# EAGLE design Schematic (EAGLE 7.7.0)
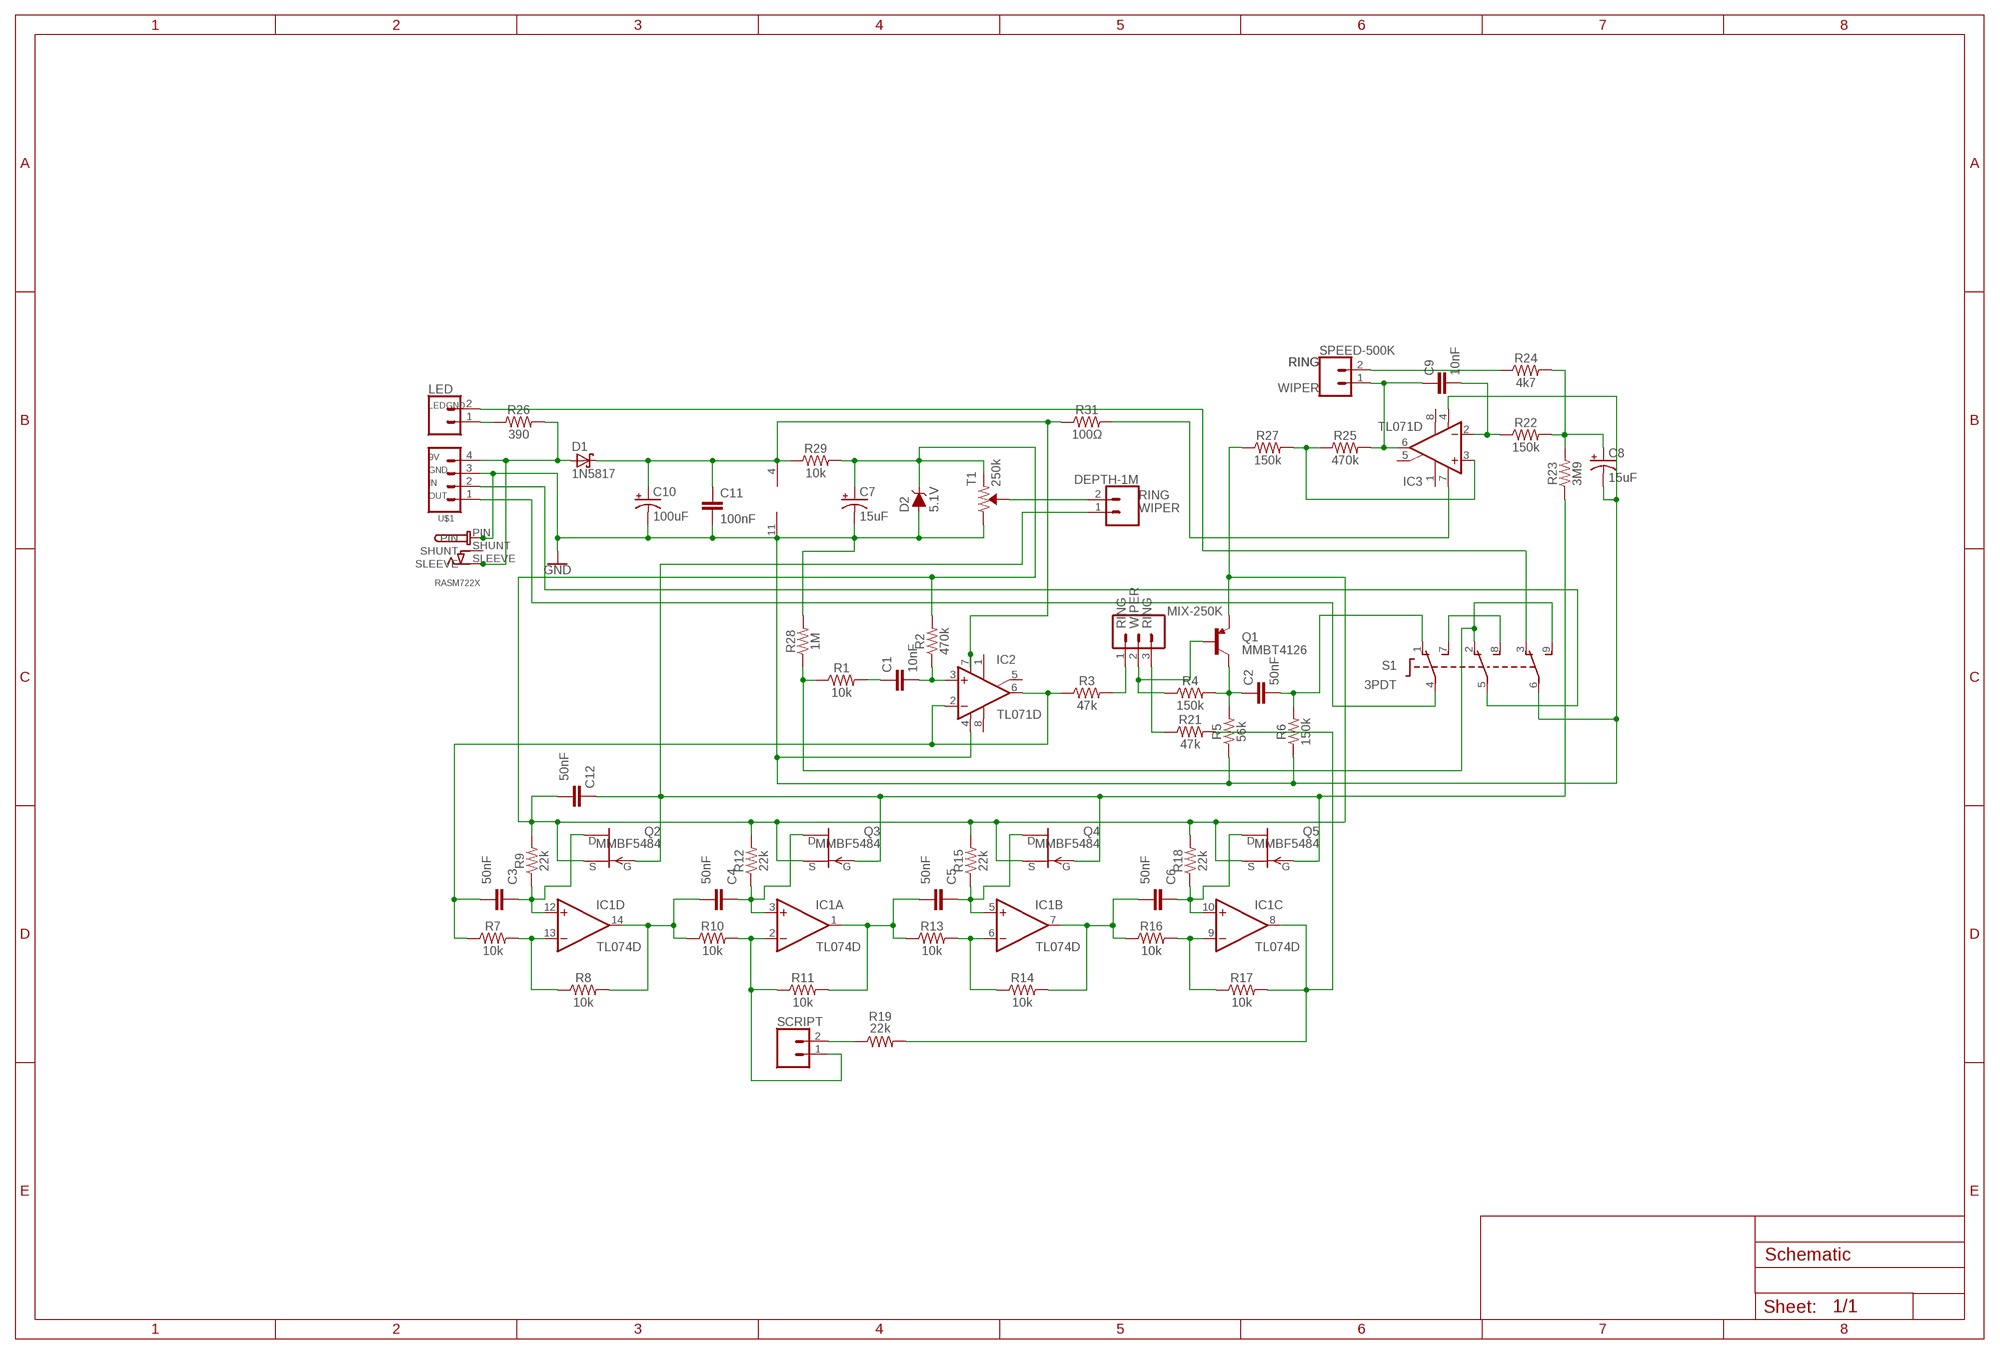
[diagram p0: schematic, sheet 1]

## Parts
C1  10nF  0.1UF-0603-25V-(+80/-20%)  [0603]
C2  50nF  0.1UF-0603-25V-(+80/-20%)  [0603]
C3  50nF  10NF-0603-50V-10%  [0603]
C4  50nF  10NF-0603-50V-10%  [0603]
C5  50nF  10NF-0603-50V-10%  [0603]
C6  50nF  10NF-0603-50V-10%  [0603]
C7  15uF  100UF-POLAR-EIA7343-10V-10%(TANT)  [EIA7343]
C8  15uF  100UF-POLAR-EIA7343-10V-10%(TANT)  [EIA7343]
C9  10nF  0.1UF-0603-25V-(+80/-20%)  [0603]
C10  100uF  100UF-POLAR-EIA7343-10V-10%(TANT)  [EIA7343]
C11  100nF  0.1UF-0603-25V-(+80/-20%)  [0603]
C12  50nF  10NF-0603-50V-10%  [0603]
D1  1N5817  1N5817-T  [DO41-7.6]
D2  5.1V  DIODE-ZENER-BZT52C3V6S  [SOD-323]
DEPTH-1M  CONN_02  [1X02]
IC1  TL074D  [SO14]
IC2  TL071D  [SO08]
IC3  TL071D  [SO08]
J2  CONN_04  [1X04]
LED  CONN_02  [1X02]
MIX-250K  CONN_03  [1X03]
Q1  MMBT4126  TRANSISTOR_PNPMMBT4403  [SOT23-3]
Q2  MMBF5484  SST5484  [SOT23]
Q3  MMBF5484  SST5484  [SOT23]
Q4  MMBF5484  SST5484  [SOT23]
Q5  MMBF5484  SST5484  [SOT23]
R1  10k  10KOHM-0603-1/10W-1%  [0603]
R2  470k  22KOHM-0603-1/10W-1%  [0603]
R3  47k  10KOHM-0603-1/10W-1%  [0603]
R4  150k  10KOHM-0603-1/10W-1%  [0603]
R5  56k  22KOHM-0603-1/10W-1%  [0603]
R6  150k  22KOHM-0603-1/10W-1%  [0603]
R7  10k  10KOHM-0603-1/10W-1%  [0603]
R8  10k  10KOHM-0603-1/10W-1%  [0603]
R9  22k  22KOHM-0603-1/10W-1%  [0603]
R10  10k  10KOHM-0603-1/10W-1%  [0603]
R11  10k  10KOHM-0603-1/10W-1%  [0603]
R12  22k  22KOHM-0603-1/10W-1%  [0603]
R13  10k  10KOHM-0603-1/10W-1%  [0603]
R14  10k  10KOHM-0603-1/10W-1%  [0603]
R15  22k  22KOHM-0603-1/10W-1%  [0603]
R16  10k  10KOHM-0603-1/10W-1%  [0603]
R17  10k  10KOHM-0603-1/10W-1%  [0603]
R18  22k  22KOHM-0603-1/10W-1%  [0603]
R19  22k  10KOHM-0603-1/10W-1%  [0603]
R21  47k  10KOHM-0603-1/10W-1%  [0603]
R22  150k  10KOHM-0603-1/10W-1%  [0603]
R23  3M9  10KOHM-0603-1/10W-1%  [0603]
R24  4k7  10KOHM-0603-1/10W-1%  [0603]
R25  470k  10KOHM-0603-1/10W-1%  [0603]
R26  390  10KOHM-0603-1/10W-1%  [0603]
R27  150k  10KOHM-0603-1/10W-1%  [0603]
R28  1M  10KOHM-0603-1/10W-1%  [0603]
R29  10k  10KOHM-0603-1/10W-1%  [0603]
R31  100Ω  10KOHM-0603-1/10W-1%  [0603]
S1  3PDT  [3PDT]
SCRIPT  CONN_02  [1X02]
SPEED-500K  CONN_02  [1X02]
T1  250k  TRIMPOT-SMD-3MM-CLOSED-1/8W-20%  [TRIMPOT-SMD-3MM-CLOSED]
U$1  RASM722X  [SWITCHCRAFT_RASM722X]

## Nets
4: C10.A(+) C11.1 D1.C IC1.4(P:V+) IC2.7(V+) R29.1 R31.1
9V: D1.A J2.4 R26.2 U$1.SLEEVE
GND: C7.C(-) C8.C(-) C10.C(-) C11.2 D2.A IC1.11(P:V-) IC2.4(V-) IC3.4(V-) J2.3 R5.1 R6.1 R28.2 S1.6(P3) T1.3(CW) U$1.PIN
IN: J2.2 S1.5(P2)
INN: R1.1 R28.1 S1.2(O2) S1.9(S3)
LEDGND: LED.2 S1.3(O3)
N$1: C4.2 IC1.14(D:OUT) R8.2 R10.1
N$2: IC1.13(D:-IN) R7.2 R8.1
N$3: MIX-250K.1 R3.2
N$4: C1.2 IC2.3(+IN) R2.1
N$5: C3.1 IC1.12(D:+IN) Q2.1(D) R9.1
N$6: MIX-250K.3 R21.1
N$7: C6.2 IC1.7(B:OUT) R14.2 R16.1
N$8: C5.2 IC1.1(A:OUT) R11.2 R13.1
N$9: IC1.2(A:-IN) R10.2 R11.1 SCRIPT.1
N$10: R19.1 SCRIPT.2
N$11: C4.1 IC1.3(A:+IN) Q3.1(D) R12.1
N$12: LED.1 R26.1
N$13: IC1.6(B:-IN) R13.2 R14.1
N$14: IC1.8(C:OUT) R17.2 R19.2 R21.2
N$15: C5.1 IC1.5(B:+IN) Q4.1(D) R15.1
N$16: MIX-250K.2 Q1.1(B) R4.1
N$17: C1.1 R1.2
N$18: IC1.9(C:-IN) R16.2 R17.1
N$19: C3.2 IC2.2(-IN) IC2.6(OUT) R3.1 R7.1
N$20: C6.1 IC1.10(C:+IN) Q5.1(D) R18.1
N$21: C12.1 DEPTH-1M.1 Q2.3(G) Q3.3(G) Q4.3(G) Q5.3(G) R23.1
N$22: C2.1 Q1.3(C) R4.2 R5.2
N$23: IC3.7(V+) R31.2
N$24: C9.2 IC3.2(-IN) R22.1
N$25: C8.A(+) R22.2 R23.2 R24.2
N$26: C7.A(+) C12.2 D2.C Q1.2(E) Q2.2(S) Q3.2(S) Q4.2(S) Q5.2(S) R2.2 R9.2 R12.2 R15.2 R18.2 R27.1 R29.2 T1.1(CCW)
N$28: C2.2 R6.2 S1.1(O1)
N$29: IC3.3(+IN) R25.1 R27.2
N$31: S1.7(S1) S1.8(S2)
OUT: J2.1 S1.4(P1)
QWEF: DEPTH-1M.2 T1.2(WIPER)
RING: R24.1 SPEED-500K.2
WIPER: C9.1 IC3.6(OUT) R25.2 SPEED-500K.1
Unconnected: IC2.1(ON1) IC2.5(ON2) IC2.8(OPT) IC3.1(ON1) IC3.5(ON2) IC3.8(OPT)

## Power pins joined to a net without a drawn wire
SHUNT: U$1.SHUNT

## Library data of the parts
C1 C2 C9 C11 = SparkFun-Capacitors:0.1UF: 0.1µF ceramic capacitors A capacitor is a passive two-terminal electrical component used to store electrical energy temporarily in an electric field.; PROD_ID: CAP-00810; VALUE: 0.1uF
C3-C6 C12 = SparkFun-Capacitors:10NF: 0.01uF/10nF/10,000pF ceramic capacitors A capacitor is a passive two-terminal electrical component used to store electrical energy temporarily in an electric field. CAP-09321; PROD_ID: CAP-00867; VALUE: 10nF
C7 C8 = SparkFun-Capacitors:100UF-POLAR: 100µF polarized capacitors A capacitor is a passive two-terminal electrical component used to store electrical energy temporarily in an electric field.; PROD_ID: CAP-07890; VALUE: 100uF
C10 = SparkFun-Capacitors:100UF-POLAR: 100µF polarized capacitors A capacitor is a passive two-terminal electrical component used to store electrical energy temporarily in an electric field.; PROD_ID: CAP-07890
D1 = diode:1N581*: 1.0A SCHOTTKY BARRIER RECTIFIER Source: http://www.diodes.com/datasheets/ds23001.pdf
D2 = SparkFun-DiscreteSemi:DIODE-ZENER: Zener Diode A Zener diode allows current to flow from its anode to its cathode like a normal semiconductor diode, but it also permits current to flow in the reverse direction when its "Zener voltage" is reached. - WIkipedia; PROD_ID: DIO-08199; VALUE: 3.6V
DEPTH-1M LED SCRIPT SPEED-500K = SparkFun-Connectors:CONN_02: Multi connection point. Often used as Generic Header-pin footprint for 0.1 inch spaced/style header connections On any of the 0.1 inch spaced packages, you can populate with these: Break Away Headers - Straight <https://www.sparkfun.com/products/116> (PRT-00116) Break Away Male Headers - Right Angle <https://www.sparkfun.com/products/553> (PRT-00553) Female Headers <https://www.sparkfun.com/products/115> (PRT-00115) Break Away Headers - Machine Pin <https://www.sparkfun.com/products/117> (PRT-00117) Break Away Female Headers - Swiss Machine Pin <https://www.sparkfun.com/products/743> (PRT-00743) For SCREWTERMINALS and SPRING TERMINALS visit here: Screw Terimnals on SparkFun.com <https://www.sparkfun.com/search/results?term=Screw+Terminals> (5mm/3.5mm/2.54mm spacing) This device is also useful as a general connection point to wire up your design to another part of your project. Our various solder wires solder well into these plated through hole pads. Hook-Up Wire - Assortment (Stranded, 22 AWG) <https://www.sparkfun.com/products/11375> (PRT-11375) Hook-Up Wire - Assortment (Solid Core, 22 AWG) <https://www.sparkfun.com/products/11367> (PRT-11367) View the entire wire category on our website here <https://www.sparkfun.com/categories/141> Special notes: Molex polarized connector foot print use with: PRT-08233 with associated crimp pins and housings. 2.54_SCREWTERM for use with PRT-10571. 3.5mm Screw Terminal footprints for PRT-08084 5mm Screw Terminal footprints for use with PRT-08432
IC1 = linear:TL074: OP AMP
IC2 IC3 = linear:TL071: OP AMP
J2 = SparkFun-Connectors:CONN_04: Multi connection point. Often used as Generic Header-pin footprint for 0.1 inch spaced/style header connections On any of the 0.1 inch spaced packages, you can populate with these: Break Away Headers - Straight <https://www.sparkfun.com/products/116> (PRT-00116) Break Away Male Headers - Right Angle <https://www.sparkfun.com/products/553> (PRT-00553) Female Headers <https://www.sparkfun.com/products/115> (PRT-00115) Break Away Headers - Machine Pin <https://www.sparkfun.com/products/117> (PRT-00117) Break Away Female Headers - Swiss Machine Pin <https://www.sparkfun.com/products/743> (PRT-00743) For SCREWTERMINALS and SPRING TERMINALS visit here: Screw Terimnals on SparkFun.com <https://www.sparkfun.com/search/results?term=Screw+Terminals> (5mm/3.5mm/2.54mm spacing) This device is also useful as a general connection point to wire up your design to another part of your project. Our various solder wires solder well into these plated through hole pads. Hook-Up Wire - Assortment (Stranded, 22 AWG) <https://www.sparkfun.com/products/11375> (PRT-11375) Hook-Up Wire - Assortment (Solid Core, 22 AWG) <https://www.sparkfun.com/products/11367> (PRT-11367) View the entire wire category on our website here <https://www.sparkfun.com/categories/141> Special notes: Molex polarized connector foot print use with SKU : PRT-08231 with associated crimp pins and housings. 1MM SMD Version SKU: PRT-10208; PROD_ID: CONN-09696
MIX-250K = SparkFun-Connectors:CONN_03: Multi connection point. Often used as Generic Header-pin footprint for 0.1 inch spaced/style header connections On any of the 0.1 inch spaced packages, you can populate with these: Break Away Headers - Straight <https://www.sparkfun.com/products/116> (PRT-00116) Break Away Male Headers - Right Angle <https://www.sparkfun.com/products/553> (PRT-00553) Female Headers <https://www.sparkfun.com/products/115> (PRT-00115) Break Away Headers - Machine Pin <https://www.sparkfun.com/products/117> (PRT-00117) Break Away Female Headers - Swiss Machine Pin <https://www.sparkfun.com/products/743> (PRT-00743) Stackable Header - 3 Pin (Female, 0.1") <https://www.sparkfun.com/products/13875> (PRT-13875) For SCREWTERMINALS and SPRING TERMINALS visit here: Screw Terimnals on SparkFun.com <https://www.sparkfun.com/search/results?term=Screw+Terminals> (5mm/3.5mm/2.54mm spacing) This device is also useful as a general connection point to wire up your design to another part of your project. Our various solder wires solder well into these plated through hole pads. Hook-Up Wire - Assortment (Stranded, 22 AWG) <https://www.sparkfun.com/products/11375> (PRT-11375) Hook-Up Wire - Assortment (Solid Core, 22 AWG) <https://www.sparkfun.com/products/11367> (PRT-11367) View the entire wire category on our website here <https://www.sparkfun.com/categories/141> Special notes: Molex polarized connector foot print use with SKU : PRT-08232 with associated crimp pins and housings.
Q1 = User-Submitted:TRANSISTOR_PNP: Generic PNP BJT Double check pinouts against datasheets- not all devices are the same! MMBT3906 - 40V 200mA SOT-23 (TRANS-08052) MMBT4403 - 40V 600mA SOT-23 (TRANS-09245); PROD_ID: TRANS-09245; VALUE: MMBT4403
Q2-Q5 = transistor-fet:?548*: N-Channel JFETs Source: VISHAY 2N5484.pdf Compatible: TO92 2N5245 J304 J305 U310 J308 J309 J310 TO72 2N4416 2N4416A 2N3823 2N4351 3N169 3N170 3N171 MFE3002 TO18 2N3796 2N3797 MFE825 Source: Motorola European Master Guide Pacge 3-59
R1 R7 R8 R10 R11 R13 R14 R16 R17 R29 = SparkFun-Resistors:10KOHM: 10kΩ resistor A resistor is a passive two-terminal electrical component that implements electrical resistance as a circuit element. Resistors act to reduce current flow, and, at the same time, act to lower voltage levels within circuits. - Wikipedia; PROD_ID: RES-00824
R2 R5 R6 = SparkFun-Resistors:22KOHM: 22kΩ resistor A resistor is a passive two-terminal electrical component that implements electrical resistance as a circuit element. Resistors act to reduce current flow, and, at the same time, act to lower voltage levels within circuits. - Wikipedia; PROD_ID: RES-07853; VALUE: 22k
R3 R4 R19 R21-R28 R31 = SparkFun-Resistors:10KOHM: 10kΩ resistor A resistor is a passive two-terminal electrical component that implements electrical resistance as a circuit element. Resistors act to reduce current flow, and, at the same time, act to lower voltage levels within circuits. - Wikipedia; PROD_ID: RES-00824; VALUE: 10k
R9 R12 R15 R18 = SparkFun-Resistors:22KOHM: 22kΩ resistor A resistor is a passive two-terminal electrical component that implements electrical resistance as a circuit element. Resistors act to reduce current flow, and, at the same time, act to lower voltage levels within circuits. - Wikipedia; PROD_ID: RES-07853
S1 = switch:3PDT: 3PDT 9 pin footswitch SF17020F-0302-21R-L Source: 3PDT.jpg
T1 = SparkFun-Resistors:TRIMPOT: Trimming Potentiometer (Trimpot) Three-terminal potentiometers, with an adjustable wiper and two adjustable resistors. A pot can be used to create a configurable voltage divider, or as a variable resistor. "Trimpots" are a subset of potentiometers, usually intended for "set-and-forget" applications. They're often more delicate than standard potentiometers - rated for fewer turns. Variants PTH-KNOB - PTH Trimpot w/ finger-adjustable knob Trimpot 10K with Knob <https://www.sparkfun.com/products/9806> (COM-09806) Datasheet <http://www.sparkfun.com/datasheets/Components/General/TSR-3386.pdf> SMD-3MM-CLOSED-FRAME - SMD 3mm Square Closed-Frame Trimpot Used on e.g. EasyDriver - Stepper Motor Driver <https://www.sparkfun.com/products/12779> Datasheet <http://www.bitechnologies.com/pdfs/22.pdf> (22AR10KTR) SMD-5MM - SMD 5mm Square Closed-Frame Trimpot Used on e.g. IOIO-OTG - V2.2 <https://www.sparkfun.com/products/13613> Datasheet <http://www.vishay.com/docs/51008/ts53.pdf> (TS53YL502MR10) SMD-3MM-1/10W-25% - 3mm Square Open-Frame Trimpot Used on e.g. SparkFun Shapeoko <https://www.sparkfun.com/products/13899> Datasheet <http://www.bourns.com/docs/Product-Datasheets/TC33.pdf> (TC33X-2-103E); PROD_ID: RES-09285; VALUE: 10k
U$1 = RASM722X:RASM722X: Connector; Miniature Power Jack; 0.57 in.; 0.08; Surface Mount; AVAILABILITY: Good; DESCRIPTION: Connector; Miniature Power Jack; 0.57 in.; 0.08; Surface Mount; MF: Switchcraft; MP: RASM722X; PACKAGE: None; PRICE: 0.97 USD

## Net classes
0 default: width 0.152 mm, drill 0.33 mm, clearance 0.152 mm

## Board
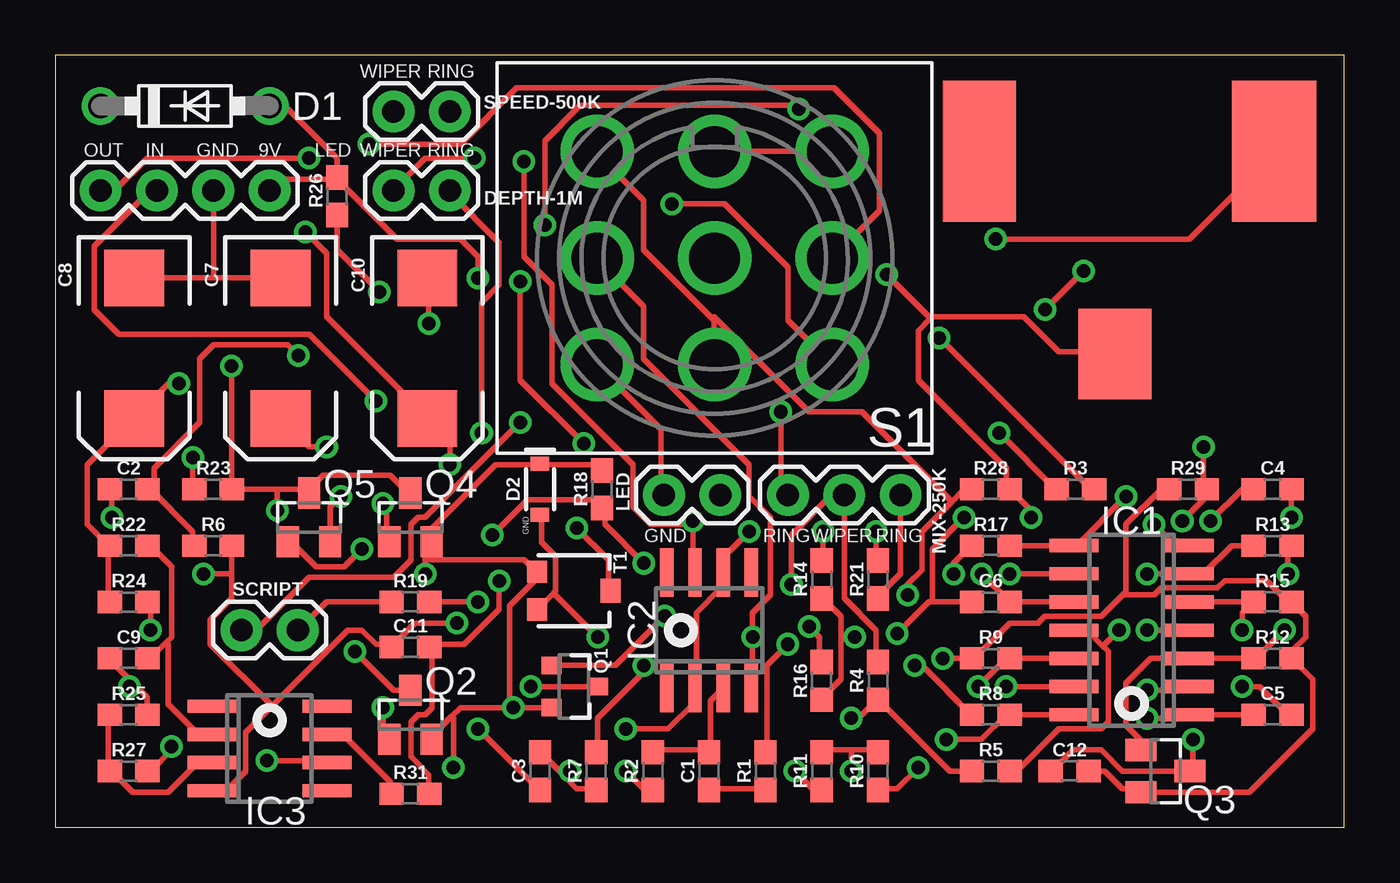
[diagram p1: board, top side]
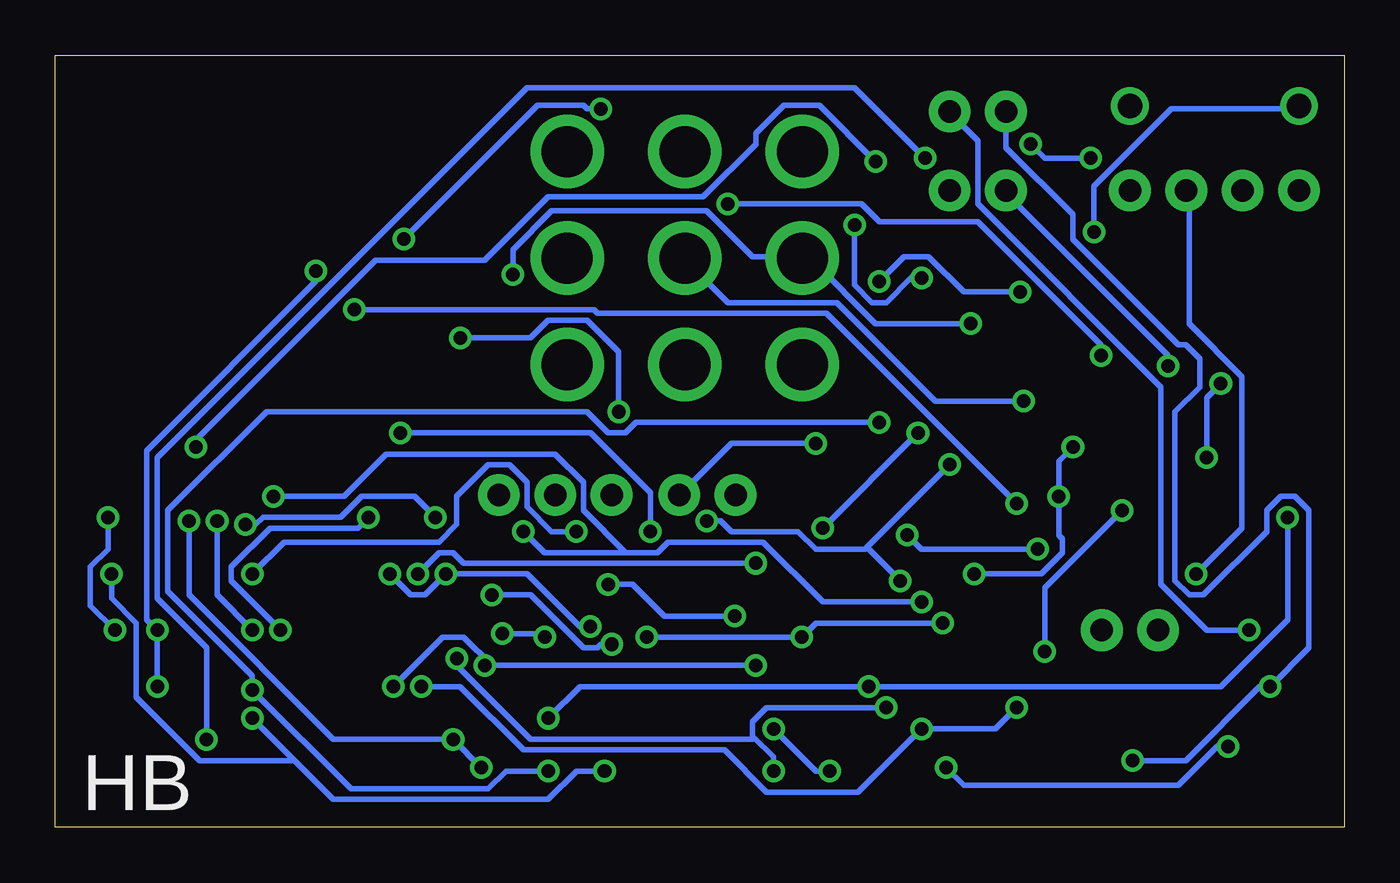
[diagram p2: board, bottom side, seen from below]

Size 58.09 x 34.79 mm. Coordinates in mm from the lower left corner, seen from the top.
Outline: 0,0 58.09,0 58.09,34.79 0,34.79 0,0
Copper layers (1*16): Top 0.035mm / dielectric 1.5mm / Bottom 0.035mm
Design rules "default": minimum track width 10mil, minimum drill 24mil, track to track 8mil, track to pad 8mil, pad to pad 8mil, via to via 8mil, smd to smd 8mil, copper to edge 40mil, drill to drill 8mil, minimum pad ring 10mil, minimum via ring 8mil, stop-mask expansion 4mil, vias tented up to drill 0mil, thermal gap 10mil

### Footprints (pad centres in the part's own frame; a part is rotated, then mirrored left to right if it is on the bottom)
0603 = smd 1.1 x 1: 1 -0.85,0; 2 0.85,0
EIA7343 = smd 2.55 x 2.7: A 3.17,0; C -3.17,0
DO41-7.6 = drill 1.1 pad 1.7: A 3.81,0; C -3.81,0
SOD-323 = smd 0.63 x 0.83: A 1.15,0; C -1.15,0
1X02 = drill 1.016 pad 1.88: 1 0,0; 2 2.54,0
SO14 = smd 0.6 x 2.2: 1 -3.81,-2.6; 2 -2.54,-2.6; 3 -1.27,-2.6; 4 0,-2.6; 5 1.27,-2.6; 6 2.54,-2.6; 7 3.81,-2.6; 8 3.81,2.6; 9 2.54,2.6; 10 1.27,2.6; 11 0,2.6; 12 -1.27,2.6; 13 -2.54,2.6; 14 -3.81,2.6
SO08 = smd 0.6 x 2.2: 1 -1.905,-2.6; 2 -0.635,-2.6; 3 0.635,-2.6; 4 1.905,-2.6; 5 1.905,2.6; 6 0.635,2.6; 7 -0.635,2.6; 8 -1.905,2.6
1X04 = drill 1.016 pad 1.88: 1 0,0; 2 2.54,0; 3 5.08,0; 4 7.62,0
1X03 = drill 1.016 pad 1.88: 1 0,0; 2 2.54,0; 3 5.08,0
SOT23-3 = smd 0.8 x 0.9: 1 -0.95,-1; 2 0.95,-1; 3 0,1.1
SOT23 = smd 1 x 1.4: 1 -0.95,-1.1; 2 0.95,-1.1; 3 0,1.1
3PDT = drill 2.3 pad 3.1: 1 -5.3,4.8; 2 0,4.8; 3 5.3,4.8; 4 -5.3,0; 5 0,0; 6 5.3,0; 7 -5.3,-4.8; 8 0,-4.8; 9 5.3,-4.8
TRIMPOT-SMD-3MM-CLOSED = smd 1 x 0.9: 1 -0.85,-1.65; 3 0.85,-1.65 | smd 1.1 x 0.9: 2 0,1.65
SWITCHCRAFT_RASM722X = smd 3.3 x 4.06: PIN 0,0 | smd 3.3 x 6.35: SHUNT 6.099,-9.14 | smd 3.81 x 6.35: SLEEVE -7.189,-9.14

### Placement (x,y rotation side)
C1  29.46,2.54 90 top
C2  3.3,15.24 0 top
C3  21.84,2.54 90 top
C4  54.86,15.24 180 top
C5  54.86,5.08 180 top
C6  42.16,10.16 180 top
C7  10.16,21.59 270 top
C8  3.56,21.59 270 top
C9  3.3,7.62 0 top
C10  16.76,21.59 270 top
C11  16,8.13 180 top
C12  45.72,2.54 0 top
D1  5.84,32.51 0 top
D2  21.84,15.24 270 top
DEPTH-1M  15.24,28.7 0 top
IC1  48.51,8.89 90 top
IC2  29.46,8.89 0 top
IC3  9.65,3.56 270 top
J2  2.03,28.7 0 top
LED  29.97,14.99 180 top
MIX-250K  33.02,14.99 0 top
Q1  23.37,6.35 270 top
Q2  16,5.08 0 top
Q3  50.04,2.54 270 top
Q4  16,13.97 0 top
Q5  11.43,13.97 0 top
R1  32,2.54 270 top
R2  26.92,2.54 270 top
R3  45.97,15.24 0 top
R4  37.08,6.6 270 top
R5  42.16,2.54 180 top
R6  7.11,12.7 180 top
R7  24.38,2.54 90 top
R8  42.16,5.08 0 top
R9  42.16,7.62 180 top
R10  37.08,2.54 90 top
R11  34.54,2.54 270 top
R12  54.86,7.62 0 top
R13  54.86,12.7 180 top
R14  34.54,11.18 270 top
R15  54.86,10.16 0 top
R16  34.54,6.6 90 top
R17  42.16,12.7 0 top
R18  24.64,15.24 90 top
R19  16,10.16 0 top
R21  37.08,11.18 90 top
R22  3.3,12.7 180 top
R23  7.11,15.24 180 top
R24  3.3,10.16 180 top
R25  3.3,5.08 0 top
R26  12.7,28.45 90 top
R27  3.3,2.54 180 top
R28  42.16,15.24 0 top
R29  51.05,15.24 180 top
R31  16,1.52 180 top
S1  29.72,25.65 180 top
SCRIPT  8.38,8.89 0 top
SPEED-500K  15.24,32.26 0 top
T1  23.37,10.67 270 top
U$1  47.75,21.34 180 top

### Tracks (layer width: path | path; a pad name or v marks a point on that pad's centre or on a via)
4  (via drill 0.61)
  Top 0.254: 51.75,15.24 51.75,14.76 v50.8,13.81 | IC1.4 v49.21,8.89 | R31.1 16.83,1.59 16.83,2.38 16.03,3.17 16.03,4.76 16.35,5.08 16.67,5.08 16.99,5.4 16.99,8.1 C11.1 16.99,8.26 18.41,8.26 20,9.84 v20,11.11 | 28.73,13.65 28.73,11.59 IC2.7 | v17.78,16.35 17.78,17.46 16.83,18.41 C10.A 16.67,18.57 12.22,23.02 12.22,25.88 v11.27,26.83 | v51.75,17.14 51.75,15.24 | v21.11,30 21.11,25.72 22.38,24.45 22.38,20 26.04,16.35 26.04,14.45 26.83,13.65 28.73,13.65 | 51.75,15.24 R29.1 | 28.73,13.65 v28.73,13.81
  Bottom 0.254: v50.8,13.81 50.8,10.48 v49.21,8.89 | v28.73,13.81 28.1,13.81 27.62,13.34 24.61,13.34 23.81,12.54 21.59,12.54 21.51,12.62 | v17.78,16.35 21.51,12.62 | 21.51,12.62 v20,11.11 | v11.27,26.83 11.27,28.89 7.78,32.38 2.06,32.38 D1.C | v51.75,17.14 51.75,17.46 43.66,25.56 38.73,25.56 35.88,28.42 28.89,28.42 26.51,30.8 26.51,31.27 25.24,32.54 23.65,32.54 v21.11,30
9V  (via drill 0.61)
  Top 0.254: 12.7,29.21 10.16,29.21 J2.4 | D1.A 9.68,32.38 10.48,32.38 12.7,30.16 R26.2 12.7,29.21 | 12.7,29.21 15.4,26.51 18.26,26.51 19.05,25.72 v19.05,24.77 | v22.07,27.15 22.07,30.96 23.65,32.54 33.34,32.54 v33.5,32.38 | v42.39,26.51 51.12,26.51 54.93,30.32 U$1.SLEEVE
  Bottom 0.254: v19.05,24.77 19.53,24.77 20.64,23.65 21.27,23.65 22.07,24.45 v22.07,27.15 | v33.5,32.38 34.13,32.38 34.29,32.54 36.35,32.54 v42.39,26.51
GND  (via drill 0.61)
  Top 0.254: 7.14,24.77 C7.C | 7.14,24.77 3.65,24.77 C8.C | 7.14,24.77 7.14,28.57 J2.3 | 9.76,5.48 8.57,4.29 8.57,2.54 7.78,1.75 7.14,1.75 IC3.4 | 9.76,5.48 13.18,8.89 13.81,8.89 14.45,8.26 15.08,8.26 C11.2 15.24,8.26 16.19,9.21 v18.1,9.21 | 7.94,11.43 7.94,10.32 6.99,9.37 6.99,8.26 9.76,5.48 | 7.94,11.43 7.94,12.7 R6.1 | 7.94,11.43 v6.67,11.43 | R5.1 43.34,2.54 45.24,4.45 47.15,4.45 47.47,4.76 47.47,7.94 47.23,8.18 | 47.23,8.18 46.51,8.89 IC1.11 | 39.45,22.94 39.53,23.02 43.66,23.02 45.24,21.43 47.62,21.43 U$1.PIN | 39.45,22.94 38.89,22.38 38.89,20.16 42.86,16.19 42.86,15.24 R28.2 43.02,15.24 43.97,14.29 v43.97,13.97 | v47.94,8.89 47.23,8.18 | 22.46,10.56 21.75,9.84 T1.3 | 22.46,10.56 22.54,10.64 22.54,12.22 21.91,12.86 21.91,13.97 D2.A | IC2.4 31.43,6.35 v31.43,8.57 31.43,9.68 32.23,10.48 32.23,13.97 31.27,14.92 31.27,16.35 26.51,21.11 26.51,23.5 24.45,25.56 S1.6 | v24.45,8.57 22.46,10.56 | v16.83,22.7 16.83,24.61 C10.C | v37.47,24.92 39.45,22.94
  Bottom 0.254: v6.67,11.43 4.6,13.49 4.6,20.32 6.99,22.7 6.99,28.57 J2.3 | v47.94,8.89 50.16,11.11 50.16,11.75 48.42,13.49 44.45,13.49 v43.97,13.97 | v31.43,8.57 v24.45,8.57 23.81,9.21 v18.1,9.21 | v16.83,22.7 21.11,22.7 23.97,25.56 24.29,25.56 S1.6 24.45,25.72 26.67,25.72 28.73,27.78 35.72,27.78 37.47,26.04 v37.47,24.92
IN  (via drill 0.61)
  Top 0.254: v14.45,19.21 11.43,22.23 2.86,22.23 1.75,23.34 1.75,26.19 4.13,28.57 4.45,28.57 J2.2
  Bottom 0.254: v14.45,19.21 18.41,19.21 22.86,23.65 27.78,23.65 29.69,25.56 S1.5
INN  (via drill 0.61)
  Top 0.254: v33.02,8.26 32.07,7.3 32.07,3.49 R1.1 | v38.42,10.48 38.42,10.95 39.05,11.59 39.05,13.34 40.4,14.68 | 40.4,14.68 40.96,15.24 R28.1 | 29.61,22.94 26.51,26.04 26.51,28.26 24.45,30.32 S1.9 | 29.61,22.94 29.69,22.86 29.69,20.95 S1.2 | 40.4,14.68 36.35,18.73 33.97,18.73 29.69,23.02 29.61,22.94
  Bottom 0.254: v33.02,8.26 33.5,8.26 33.66,8.1 34.29,8.1 36.67,10.48 v38.42,10.48
LEDGND
  Top 0.254: LED.2 27.3,15.08 27.3,17.94 24.45,20.8 S1.3
N$1  (via drill 0.61)
  Top 0.254: v38.89,2.7 37.94,1.75 37.15,1.75 R10.1 | v40.16,3.97 41.75,3.97 42.86,5.08 R8.2 IC1.14 | C4.2 53.5,15.24 v52.07,13.81
  Bottom 0.254: v38.89,2.7 v40.16,3.97 45.56,3.97 52.07,10.48 v52.07,13.81
N$2  (via drill 0.61)
  Top 0.254: v26.51,7.3 26.51,6.99 24.45,4.92 24.45,3.49 R7.2 | v38.73,7.3 39.05,7.3 41.27,5.08 R8.1 | v42.86,6.35 IC1.13
  Bottom 0.254: 38.42,7.3 v26.51,7.3 | v42.86,6.35 40.64,8.57 39.69,8.57 38.42,7.3 | 38.42,7.3 v38.73,7.3
N$3  (via drill 0.61)
  Top 0.254: v39.85,22.07 46.67,15.24 R3.2 | v32.7,18.73 32.7,15.4 33.02,15.08 MIX-250K.1
  Bottom 0.254: v39.85,22.07 36.67,22.07 35.88,22.86 34.13,22.86 32.7,21.43 v32.7,18.73
N$4
  Top 0.254: R2.1 26.99,3.49 29.37,3.49 C1.2 29.53,3.49 29.53,5.71 30,6.19 IC2.3
N$5  (via drill 0.61)
  Top 0.254: IC1.12 R9.1 42.86,7.62 v41.59,6.35 | v19.05,4.45 21.75,1.75 C3.1 | v14.76,5.4 14.76,4.29 14.92,4.13 Q2.1
  Bottom 0.254: v14.76,5.4 15.72,4.45 v19.05,4.45 21.91,1.59 26.04,1.59 27.94,3.49 36.99,3.49 39.85,6.35 v41.59,6.35
N$6
  Top 0.254: MIX-250K.3 38.1,11.43 37.15,10.48 R21.1
N$7  (via drill 0.61)
  Top 0.254: 35.4,8.57 35.4,9.53 34.61,10.32 R14.2 | 35.4,8.57 35.4,6.67 34.61,5.87 R16.1 | 39.53,10.16 39.37,10.16 v37.94,8.73 | 39.53,10.16 C6.2 | 35.4,8.57 v36.04,8.57 | IC1.7 50.48,12.7 v49.53,13.65 | v40.96,13.97 39.53,12.54 39.53,10.16
  Bottom 0.254: v37.94,8.73 36.2,8.73 v36.04,8.57 | v49.53,13.65 49.05,13.65 48.74,13.97 45.24,13.97 44.29,14.92 41.91,14.92 v40.96,13.97
N$8  (via drill 0.61)
  Top 0.254: v33.34,2.54 34.13,1.75 34.45,1.75 R11.2 | v49.21,4.92 50.8,4.92 50.96,5.08 IC1.1 C5.2 | v55.56,11.43 55.56,12.7 R13.1
  Bottom 0.254: v33.34,2.54 34.61,2.54 35.88,1.27 45.56,1.27 47.39,3.1 | v49.21,4.92 47.39,3.1 | v55.56,11.43 55.56,10.32 54.45,9.21 54.45,5.87 51.59,3.02 47.47,3.02 47.39,3.1
N$9  (via drill 0.61)
  Top 0.254: 35.88,3.49 36.99,3.49 R10.2 | 35.88,3.49 34.61,3.49 R11.1 | v35.88,2.54 35.88,3.49 | v49.21,6.19 50.8,6.19 50.96,6.35 IC1.2 | SCRIPT.1 9.05,8.89 11.43,11.27 15.24,11.27 16.03,12.06 16.03,13.65 16.35,13.97 16.67,13.97 v20.95,18.26
  Bottom 0.254: v35.88,2.54 37.78,2.54 38.58,1.75 44.77,1.75 v49.21,6.19 49.21,6.83 53.02,10.64 53.02,14.29 48.58,18.73 34.13,18.73 33.18,17.78 32.38,17.78 31.91,18.26 v20.95,18.26
N$10
  Top 0.254: R19.1 12.22,10.16 10.95,8.89 SCRIPT.2
N$11  (via drill 0.61)
  Top 0.254: v55.72,13.97 C4.1 | v55.4,8.89 54.13,7.62 R12.1 IC1.3 49.37,7.62 48.26,6.51 48.26,4.6 48.9,3.97 48.9,3.49 Q3.1
  Bottom 0.254: v55.72,13.97 55.72,12.54 56.52,11.75 56.52,10 v55.4,8.89
N$12  (via drill 0.61)
  Top 0.254: R26.1 12.7,26.04 v14.61,24.13 | v20.95,24.61 20.95,20.16 v23.81,17.3
  Bottom 0.254: v14.61,24.13 17.14,24.13 18.73,25.72 19.84,25.72 v20.95,24.61 | v23.81,17.3 27.62,17.3 29.84,15.08 LED.1
N$13  (via drill 0.61)
  Top 0.254: v34.61,13.34 34.61,12.06 R14.1 | v49.21,11.43 IC1.6 51.75,11.43 53.02,12.7 R13.2
  Bottom 0.254: v34.61,13.34 35.72,13.34 36.83,14.45 36.83,15.56 37.62,16.35 38.58,16.35 40.01,14.92 40.01,13.65 40.8,12.86 47.78,12.86 v49.21,11.43
N$14  (via drill 0.61)
  Top 0.254: R17.2 IC1.8 46.04,12.7 v48.26,14.92 | v19.05,10.16 R19.2 | v36.99,13.34 36.99,12.06 R21.2
  Bottom 0.254: v19.05,10.16 23.5,10.16 26.19,12.86 30.48,12.86 30.96,12.38 32.38,12.38 | 32.38,12.38 36.04,12.38 v36.99,13.34 | v48.26,14.92 45.09,14.92 43.18,16.83 35.56,16.83 34.29,15.56 34.29,14.29 32.38,12.38
N$15  (via drill 0.61)
  Top 0.254: v53.5,6.35 54.29,6.35 55.56,5.08 C5.1 | v53.5,8.89 53.5,9.68 53.98,10.16 R15.1 IC1.5 | v14.76,14.61 14.92,14.45 14.92,13.02 Q4.1 | v46.35,25.08 v44.61,23.34
  Bottom 0.254: v53.5,6.35 v53.5,8.89 53.98,9.37 53.98,16.99 46.35,24.61 v46.35,25.08 | v14.76,14.61 23.34,23.18 33.66,23.18 33.81,23.34 v44.61,23.34
N$16  (via drill 0.61)
  Top 0.254: v27.46,9.53 25.24,7.3 22.38,7.3 Q1.1 | v33.18,10.95 33.18,13.18 34.92,14.92 35.56,14.92 | 35.56,14.92 35.56,10.32 36.99,8.89 36.99,7.46 R4.1 | 35.56,14.92 MIX-250K.2
  Bottom 0.254: v27.46,9.53 30.64,9.53 32.07,10.95 v33.18,10.95
N$17
  Top 0.254: C1.1 29.53,1.75 31.91,1.75 R1.2
N$18  (via drill 0.61)
  Top 0.254: v33.97,9.05 34.45,8.57 34.45,7.46 R16.2 | v40.48,11.43 40.48,11.91 41.27,12.7 R17.1 | v43.02,11.43 IC1.9
  Bottom 0.254: v33.97,9.05 34.45,9.05 36.83,11.43 v40.48,11.43 41.43,10.48 42.07,10.48 v43.02,11.43
N$19  (via drill 0.61)
  Top 0.254: 22.94,2.3 21.91,3.33 C3.2 | 22.94,2.3 23.5,1.75 24.29,1.75 R7.1 | v42.55,17.78 45.09,15.24 R3.1 | v31.27,13.34 30.16,12.22 30.16,11.59 IC2.6 30,11.43 30,10.79 28.89,9.68 28.89,6.35 IC2.2 28.73,6.19 28.73,5.56 27.62,4.45 v25.72,4.45 | v23.18,2.54 22.94,2.3
  Bottom 0.254: v42.55,17.78 33.97,17.78 31.27,15.08 v31.27,13.34 | v23.18,2.54 23.81,2.54 v25.72,4.45
N$20  (via drill 0.61)
  Top 0.254: v26.51,11.91 24.77,13.65 24.77,14.29 R18.1 24.61,14.45 24.29,14.76 21.27,14.76 v19.68,13.18 | 43.02,10.16 v41.75,11.43 | v13.81,12.54 13.02,11.75 11.75,11.75 10.64,12.86 Q5.1 | 43.02,10.16 IC1.10 | 43.02,10.16 C6.1
  Bottom 0.254: v26.51,11.91 39.69,11.91 40.16,12.38 40.8,12.38 v41.75,11.43 | v13.81,12.54 19.05,12.54 v19.68,13.18
N$21  (via drill 0.61)
  Top 0.254: 10,15.24 11.27,15.24 Q5.3 11.43,15.24 12.06,15.88 15.08,15.88 15.88,15.08 Q4.3 | 10,15.24 R23.1 7.94,15.24 v7.94,20.8 | v13.49,7.94 15.24,6.19 15.88,6.19 Q2.3 | 10,15.24 v10,14.29 | C12.1 44.93,2.54 45.88,3.49 47.15,3.49 48.1,2.54 Q3.3 51.28,2.54 v51.28,3.97 | v18.89,30.16 16.67,30.16 15.24,28.73 DEPTH-1M.1
  Bottom 0.254: v13.49,7.94 13.49,10.79 v10,14.29 | v51.28,3.97 51.28,8.1 53.5,10.32 53.5,16.67 36.83,33.34 22.07,33.34 v18.89,30.16 | v7.94,20.8 7.94,21.27 15.24,28.57 DEPTH-1M.1
N$22  (via drill 0.61)
  Top 0.254: v21.43,6.35 Q1.3 | v35.88,4.92 36.2,4.92 36.99,5.71 R4.2 37.15,5.71 40.32,2.54 R5.2 | v2.54,13.97 2.54,15.24 C2.1
  Bottom 0.254: v35.88,4.92 34.45,6.35 v21.43,6.35 5.56,6.35 2.54,9.37 v2.54,13.97
N$23
  Top 0.254: R31.2 15.08,1.59 15.08,2.06 13.02,4.13 12.38,4.13 IC3.7
N$24
  Top 0.254: 5,8.33 5.24,8.57 5.24,11.75 4.29,12.7 R22.1 | 5,8.33 4.29,7.62 C9.2 | IC3.2 6.99,4.29 6.35,4.29 5.08,5.56 5.08,8.26 5,8.33
N$25  (via drill 0.61)
  Top 0.254: 2.38,12.7 2.38,10.16 R24.2 | v6.19,16.67 6.19,15.24 R23.2 | v5.56,20 5.08,20 3.65,18.57 C8.A 3.49,18.41 1.43,16.35 1.43,13.65 2.38,12.7 | 2.38,12.7 R22.2
  Bottom 0.254: v6.19,16.67 6.19,19.37 v5.56,20
N$26  (via drill 0.61)
  Top 0.254: C12.2 47.31,2.54 48.1,1.75 48.9,1.75 Q3.2 49.05,1.59 53.82,1.59 56.67,4.45 56.67,6.67 R12.2 | R12.2 55.72,7.94 56.36,8.57 56.36,9.53 R15.2 55.56,10.16 54.61,11.11 52.7,11.11 52.39,10.79 49.85,10.79 49.53,10.48 48.26,10.48 48.18,10.56 | 48.18,10.56 48.26,10.64 48.26,13.65 49.85,15.24 R29.2 | 48.18,10.56 47.15,9.53 44.61,9.53 44.29,9.21 43.02,9.21 41.43,7.62 R9.2 v40.01,7.62 | R12.2 | v12.86,14.92 12.38,14.45 12.38,13.02 Q5.2 | v12.22,17.14 11.43,17.14 C7.A | R18.2 24.61,16.19 24.45,16.35 21.91,16.35 D2.C 21.75,16.35 19.84,16.35 16.99,13.49 16.99,13.02 Q4.2 16.83,12.86 16.67,12.7 16.67,12.06 | 16.67,12.06 v16.67,11.43 | 20.48,5.4 18.26,5.4 17.86,5 | 20.48,5.4 v20.64,5.4 22.23,5.4 Q1.2 | 17.86,5 16.99,4.13 Q2.2 | 20.48,5.4 20.48,10 21.59,11.11 21.59,11.43 T1.1 21.59,11.59 21.11,12.06 16.67,12.06 | v25.72,2.54 26.51,1.75 26.83,1.75 R2.2 | v5.24,3.65 5.24,3.49 4.29,2.54 R27.1 | v17.94,2.7 17.94,4.92 17.86,5
  Bottom 0.254: v12.22,17.14 12.86,16.51 v12.86,14.92 12.86,13.18 12.7,13.02 12.7,12.38 13.65,11.43 v16.67,11.43 | v25.72,2.54 25.72,3.17 26.59,4.05 | 26.59,4.05 26.67,4.13 26.67,4.76 26.04,5.4 v20.64,5.4 | v5.24,3.65 5.71,3.65 7.46,1.91 17.14,1.91 v17.94,2.7 | v40.01,7.62 40.01,7.3 36.67,3.97 26.67,3.97 26.59,4.05
N$28  (via drill 0.61)
  Top 0.254: R6.2 6.19,12.7 6.19,13.34 4.29,15.24 C2.2 4.45,15.24 4.45,16.19 6.51,18.26 6.51,21.11 7.14,21.75 10.48,21.75 v10.95,21.27 | v27.78,28.1 30.16,28.1 33.02,25.24 33.02,22.86 34.92,20.95 S1.1
  Bottom 0.254: v10.95,21.27 10.95,21.75 16.51,27.3 20.95,27.3 21.75,28.1 v27.78,28.1
N$29
  Top 0.254: R25.1 2.38,5.08 2.38,2.54 R27.2 2.54,2.54 3.49,1.59 5.08,1.59 6.35,2.86 6.99,2.86 IC3.3
N$31
  Top 0.254: S1.8 29.84,30.48 34.92,30.48 S1.7
OUT  (via drill 0.61)
  Top 0.254: v11.43,30.16 4.13,30.16 2.7,28.73 2.06,28.73 J2.1 | v14.13,30.8 18.26,30.8 20.8,33.34 35.08,33.34 37.15,31.27 37.15,27.78 35.08,25.72 S1.4
  Bottom 0.254: v11.43,30.16 13.49,30.16 v14.13,30.8
QWEF  (via drill 0.61)
  Top 0.254: v23.5,13.49 24.92,12.06 24.92,10.79 T1.2 | v19.21,17.78 19.21,23.65 20,24.45 20,26.35 17.78,28.57 DEPTH-1M.2
  Bottom 0.254: v19.21,17.78 v23.5,13.49
RING  (via drill 0.61)
  Top 0.254: v4.29,8.89 4.29,10.16 R24.1
  Bottom 0.254: v4.29,8.89 6.19,8.89 8.26,10.95 8.26,19.84 16.51,28.1 16.51,30.96 17.78,32.23 SPEED-500K.2
WIPER  (via drill 0.61)
  Top 0.254: 3.41,6.59 2.38,7.62 C9.1 | 3.41,6.59 4.13,5.87 4.13,5.08 R25.2 | v9.53,3.02 12.22,3.02 IC3.6 | v3.33,6.35 3.33,6.51 3.41,6.59
  Bottom 0.254: v9.53,3.02 7.14,3.02 3.81,6.35 v3.33,6.35 1.59,8.1 1.59,14.29 2.22,14.92 2.86,14.92 3.49,14.29 3.49,13.34 6.35,10.48 6.99,10.48 7.62,11.11 7.62,18.73 6.51,19.84 6.51,21.11 7.14,21.75 7.46,21.75 12.22,26.51 12.22,27.62 15.24,30.64 SPEED-500K.1

### Text on the board
tPlace: WIPER | RING | OUT | IN | GND | 9V | LED | WIPER | RING | GND | GND | RING | WIPER | RING
bPlace: HB